# EAGLE design pc_afe44xx_shield_v2 (EAGLE 6.4)
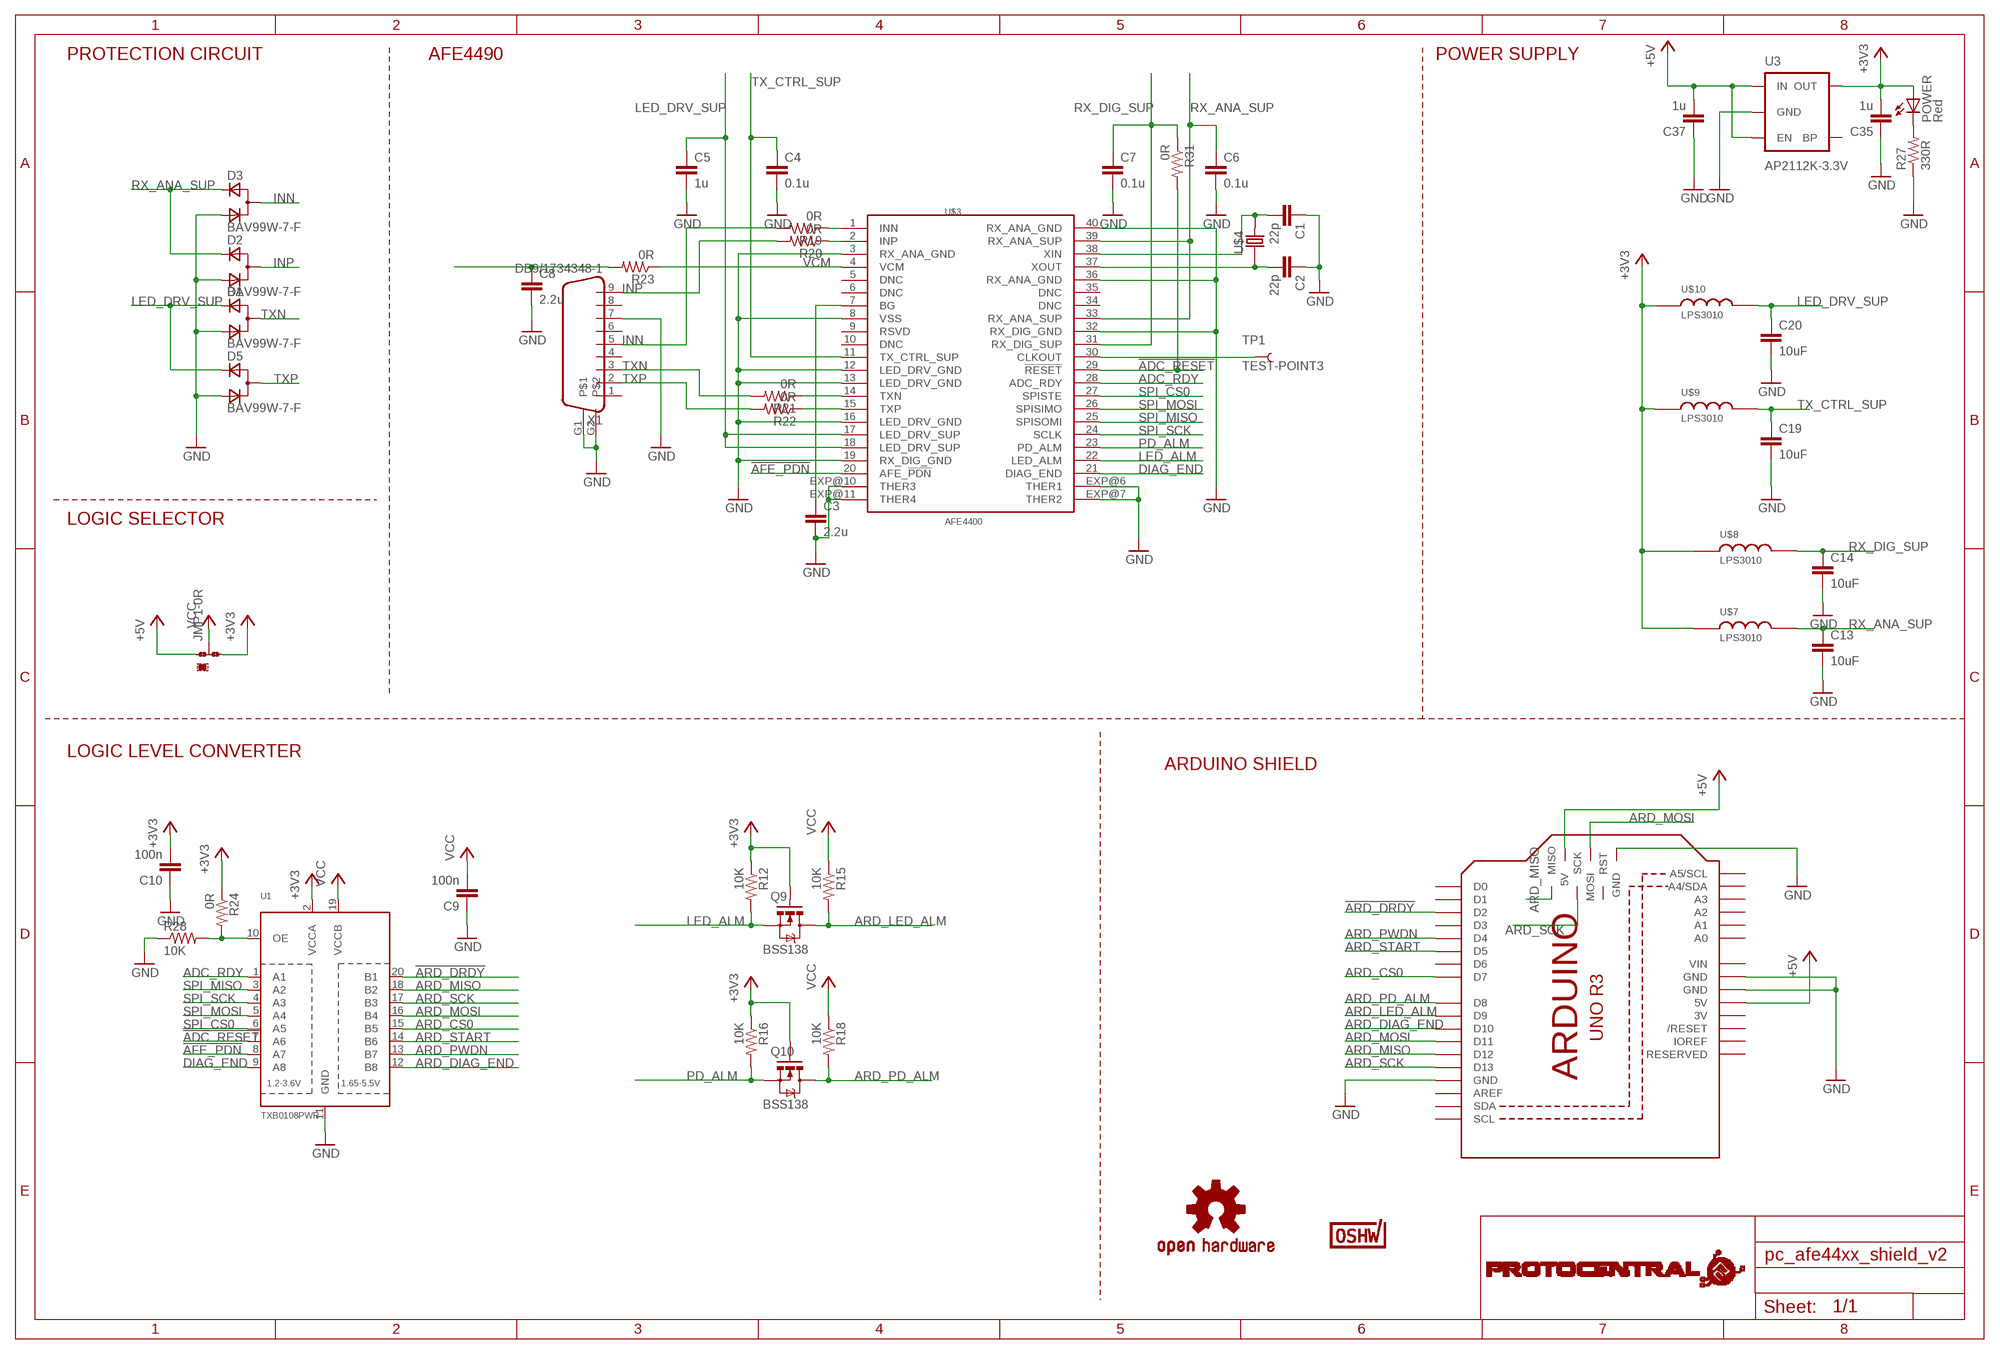
[diagram p0: schematic, sheet 1]

## Parts
C1  22p  C-EUC0402  [C0402]
C2  22p  C-EUC0402  [C0402]
C3  2.2u  C-EUC0402  [C0402]
C4  0.1u  C-EUC0805  [C0805]
C5  1u  C-EUC0805  [C0805]
C6  0.1u  C-EUC0805  [C0805]
C7  0.1u  C-EUC0805  [C0805]
C8  2.2u  C-EUC0402  [C0402]
C9  100n  C-EUC0402  [C0402]
C10  100n  C-EUC0402  [C0402]
C13  10uF  C-EUC0805  [C0805]
C14  10uF  C-EUC0805  [C0805]
C19  10uF  C-EUC0805  [C0805]
C20  10uF  C-EUC0805  [C0805]
C35  1u  C-EUC0805  [C0805]
C37  1u  C-EUC0805  [C0805]
D1  BAV99W-7-F  D_ACACSOT323  [SOT323]
D2  BAV99W-7-F  D_ACACSOT323  [SOT323]
D3  BAV99W-7-F  D_ACACSOT323  [SOT323]
D5  BAV99W-7-F  D_ACACSOT323  [SOT323]
JMP1  0R-JUMPA  [A0R-JMP]
M1  ARDUINO  [ARDUINO]
POWER  Red  LEDCHIPLED_0603  [CHIPLED_0603]
Q9  BSS138  MOSFET-NCHANNELSMD  [SOT23-3]
Q10  BSS138  MOSFET-NCHANNELSMD  [SOT23-3]
R12  10K  RESISTOR0805-RES  [0805]
R15  10K  RESISTOR0805-RES  [0805]
R16  10K  RESISTOR0805-RES  [0805]
R18  10K  RESISTOR0805-RES  [0805]
R19  0R  R-US_R0402  [R0402]
R20  0R  R-US_R0402  [R0402]
R21  0R  R-US_R0805  [R0805]
R22  0R  R-US_R0805  [R0805]
R23  0R  R-US_R0402  [R0402]
R24  0R  RESISTOR0805-RES  [0805]
R27  330R  R-US_R0805  [R0805]
R28  10K  RESISTOR0805-RES  [0805]
R31  0R  R-US_R0805  [R0805]
TP1  TEST-POINT3  [PAD.03X.03]
U1  TXB0108PWR  [TSSOP20]
U3  AP2112K-3.3V  V_REG_LDOSMD  [SOT23-5]
U$3  AFE4400  [QFN-40]
U$4  ABM3  [ABM3]
U$5  PROTY_LOGO_WITH_TEXT  [PROTY_WITH_TEXT]
U$6  CERT-SMALL  [CERT-SMALL-SILK]
U$7  LPS3010  LPS  [LPS]
U$8  LPS3010  LPS  [LPS]
U$9  LPS3010  LPS  [LPS]
U$10  LPS3010  LPS  [LPS]
U$11  OSHW-LOGOM  [OSHW-LOGO-M]
X1  DB9/1734348-1  DB9  [DB9]

## Nets
!ADC_RESET: R31.2 U1.7(A6) U$3.29(!RESET)
!AFE_PDN: U1.8(A7) U$3.20(AFE_!PDN)
!ARD_DRDY: M1.D2 U1.20(B1)
+3V3: C10.2 C35.2 JMP1.3 POWER.A Q9.1(G) Q10.1(G) R12.1 R16.1 R24.1 U1.2(VCCA) U3.5(OUT) U$7.1 U$8.1 U$9.1 U$10.1
+5V: C37.2 JMP1.1 M1.5V M1.5V_ICSP(5V) U3.1(IN) U3.3(EN)
ADC_RDY: U1.1(A1) U$3.28(ADC_RDY)
ARD_CS0: M1.D7 U1.15(B5)
ARD_DIAG_END: M1.D10 U1.12(B8)
ARD_LED_ALM: M1.D9 Q9.3(D) R15.2
ARD_MISO: M1.D12 M1.MISO U1.18(B2)
ARD_MOSI: M1.D11 M1.MOSI U1.16(B4)
ARD_PD_ALM: M1.D8 Q10.3(D) R18.2
ARD_PWDN: M1.D4 U1.13(B7)
ARD_SCK: M1.D13 M1.SCK U1.17(B3)
ARD_START: M1.D5 U1.14(B6)
DIAG_END: U1.9(A8) U$3.21(DIAG_END)
GND: C1.1 C2.1 C3.2 C4.2 C5.2 C6.2 C7.2 C8.2 C9.1 C10.1 C13.2 C14.2 C19.2 C20.2 C35.1 C37.1 D1.2(C) D2.2(C) D3.2(C) D5.2(C) M1.GND M1.GND@1(GND) M1.GND@2(GND) M1.GND@3(GND) R27.1 R28.1 U1.11(GND) U3.2(GND) U$3.3(RX_ANA_GND) U$3.8(VSS) U$3.12(LED_DRV_GND) U$3.13(LED_DRV_GND) U$3.16(LED_DRV_GND) U$3.19(RX_DIG_GND) U$3.32(RX_DIG_GND) U$3.36(RX_ANA_GND) U$3.40(RX_ANA_GND) U$3.EXP@6(THER1) U$3.EXP@7(THER2) U$3.EXP@10(THER3) U$3.EXP@11(THER4) X1.7 X1.G1 X1.G2
INN: D3.1(CA) R19.2 X1.5
INP: D2.1(CA) R20.2 X1.9
LED_ALM: Q9.2(S) R12.2 U$3.22(LED_ALM)
LED_DRV_SUP: C5.1 C20.1 D1.3(A) D5.3(A) U$3.17(LED_DRV_SUP) U$3.18(LED_DRV_SUP) U$10.2
N$2: C3.1 U$3.7(BG)
N$4: R21.1 U$3.14(TXN)
N$5: TP1.P$1 U$3.30(CLKOUT)
N$6: R22.1 U$3.15(TXP)
N$7: POWER.C R27.2
N$8: R19.1 U$3.1(INN)
N$9: C8.1 R23.2
N$10: C1.2 U$3.38(XIN) U$4.2
N$11: C2.2 U$3.37(XOUT) U$4.1
N$12: R24.2 R28.2 U1.10(OE)
N$17: R20.1 U$3.2(INP)
PD_ALM: Q10.2(S) R16.2 U$3.23(PD_ALM)
RX_ANA_SUP: C6.1 C13.1 D2.3(A) D3.3(A) U$3.33(RX_ANA_SUP) U$3.39(RX_ANA_SUP) U$7.2
RX_DIG_SUP: C7.1 C14.1 R31.1 U$3.31(RX_DIG_SUP) U$8.2
SPI_CS0: U1.6(A5) U$3.27(SPISTE)
SPI_MISO: U1.3(A2) U$3.25(SPISOMI)
SPI_MOSI: U1.5(A4) U$3.26(SPISIMO)
SPI_SCK: U1.4(A3) U$3.24(SCLK)
TX_CTRL_SUP: C4.1 C19.1 U$3.11(TX_CTRL_SUP) U$9.2
TXN: D1.1(CA) R21.2 X1.3
TXP: D5.1(CA) R22.2 X1.2
VCC: C9.2 JMP1.2 R15.1 R18.1 U1.19(VCCB)
VCM: R23.1 U$3.4(VCM)
Unconnected: M1.A0 M1.A1 M1.A2 M1.A3 M1.A4(A4/SDA) M1.A5(A5/SCL) M1.AREF M1.D0 M1.D1 M1.D3 M1.D6 M1.IOREF M1.RESERVED M1.RESET(/RESET) M1.RESET_ICSP(RST) M1.SCL M1.SDA U3.4(BP) U$3.5(DNC) U$3.6(DNC) U$3.9(RSVD) U$3.10(DNC) U$3.34(DNC) U$3.35(DNC) X1.1 X1.4 X1.6 X1.8

## Notes on the sheet
- PROTECTION CIRCUIT | AFE4490 | POWER SUPPLY
- LOGIC SELECTOR
- LOGIC LEVEL CONVERTER
- ARDUINO SHIELD

## Power pins joined to a net without a drawn wire
3V: M1.3V
VIN: M1.VIN

## Library data of the parts
C1-C10 C13 C14 C19 C20 C35 C37 = rcl:C-EU: CAPACITOR, European symbol
D1-D3 D5 = zetex:D_ACAC: Dual DIODE; OC_FARNELL: unknown; OC_NEWARK: unknown
JMP1 = jump-0r-smd:0R-JUMP: SMD 0R 0805 Jumper
M1 = circuitects:ARDUINO
POWER = led:LED: LED OSRAM: - CHIPLED LG R971, LG N971, LY N971, LG Q971, LY Q971, LO R971, LY R971 LH N974, LH R974 LS Q976, LO Q976, LY Q976 LO Q996 - Hyper CHIPLED LW Q18S LB Q993, LB Q99A, LB R99A - SideLED LS A670, LO A670, LY A670, LG A670, LP A670 LB A673, LV A673, LT A673, LW A673 LH A674 LY A675 LS A676, LA A676, LO A676, LY A676, LW A676 LS A679, LY A679, LG A679 - Hyper Micro SIDELED® LS Y876, LA Y876, LO Y876, LY Y876 LT Y87S - SmartLED LW L88C, LW L88S LB L89C, LB L89S, LG L890 LS L89K, LO L89K, LY L89K LS L896, LA L896, LO L896, LY L896 - TOPLED LS T670, LO T670, LY T670, LG T670, LP T670 LSG T670, LSP T670, LSY T670, LOP T670, LYG T670 LG T671, LOG T671, LSG T671 LB T673, LV T673, LT T673, LW T673 LH T674 LS T676, LA T676, LO T676, LY T676, LB T676, LH T676, LSB T676, LW T676 LB T67C, LV T67C, LT T67C, LS T67K, LO T67K, LY T67K, LW E67C LS E67B, LA E67B, LO E67B, LY E67B, LB E67C, LV E67C, LT E67C LW T67C LS T679, LY T679, LG T679 LS T770, LO T770, LY T770, LG T770, LP T770 LB T773, LV T773, LT T773, LW T773 LH T774 LS E675, LA E675, LY E675, LS T675 LS T776, LA T776, LO T776, LY T776, LB T776 LHGB T686 LT T68C, LB T68C - Hyper Mini TOPLED® LB M676 - Mini TOPLED Santana® LG M470 LS M47K, LO M47K, LY M47K Source: http://www.osram.convergy.de LUXEON: - LUMILED® LXK2-PW12-R00, LXK2-PW12-S00, LXK2-PW14-U00, LXK2-PW14-V00 LXK2-PM12-R00, LXK2-PM12-S00, LXK2-PM14-U00 LXK2-PE12-Q00, LXK2-PE12-R00, LXK2-PE12-S00, LXK2-PE14-T00, LXK2-PE14-U00 LXK2-PB12-K00, LXK2-PB12-L00, LXK2-PB12-M00, LXK2-PB14-N00, LXK2-PB14-P00, LXK2-PB14-Q00 LXK2-PR12-L00, LXK2-PR12-M00, LXK2-PR14-Q00, LXK2-PR14-R00 LXK2-PD12-Q00, LXK2-PD12-R00, LXK2-PD12-S00 LXK2-PH12-R00, LXK2-PH12-S00 LXK2-PL12-P00, LXK2-PL12-Q00, LXK2-PL12-R00 Source: www.luxeon.com KINGBRIGHT: KA-3528ASYC Source: www.kingbright.com
Q9 Q10 = SparkFun:MOSFET-NCHANNEL
R12 R15 R16 R18 R24 R28 = SparkFun:RESISTOR: Resistor Basic schematic elements and footprints for 0603, 1206, and PTH resistors.
R19-R23 R27 R31 = rcl:R-US_: RESISTOR, American symbol
TP1 = SparkFun:TEST-POINT
U1 = adafruit:TXB0108PWR: 8-Bit Bi-Directional Level Shifter 1.2V-3.6V (VCCA) to 1.65V-5.5V (VCCB) bi-directional level shifter with auto direction sensing. Max data rate - VCCA 1.8V: 20Mbps (50ns), VCCA 3.3V: 100Mbps (10ns) Digikey: 296-21527-1-ND
U3 = SparkFun-PowerIC:V_REG_LDO: Voltage Regulator LDO Standard 150mA LDO voltage regulator in SOT-23 layout. Micrel part MIC5205. BP (by-pass) pin is used to lower output noise with 470pF cap.; PROD_ID: VREG-12457
U$3 = circuitects:AFE4400
U$4 = circuitects:ABM3
U$5 = circuitects:PROTY_LOGO_WITH_TEXT
U$6 = OSHWA:CERT
U$7-U$10 = circuitects:LPS
U$11 = SparkFun:OSHW-LOGO: Open Source Hardware Logo This logo indicates the piece of hardware it is found on incorporates a OSHW license and/or adheres to the definition of open source hardware found here: http://freedomdefined.org/OSHW
X1 = circuitects:DB9: DB9 Connector Standard DB9 (D-Sub 9) serial connector. Can be used for CAN bus as well as RS485 and RS232. Footprint production proven. Spark Fun Electronics SKU : PRT-00429

## Board
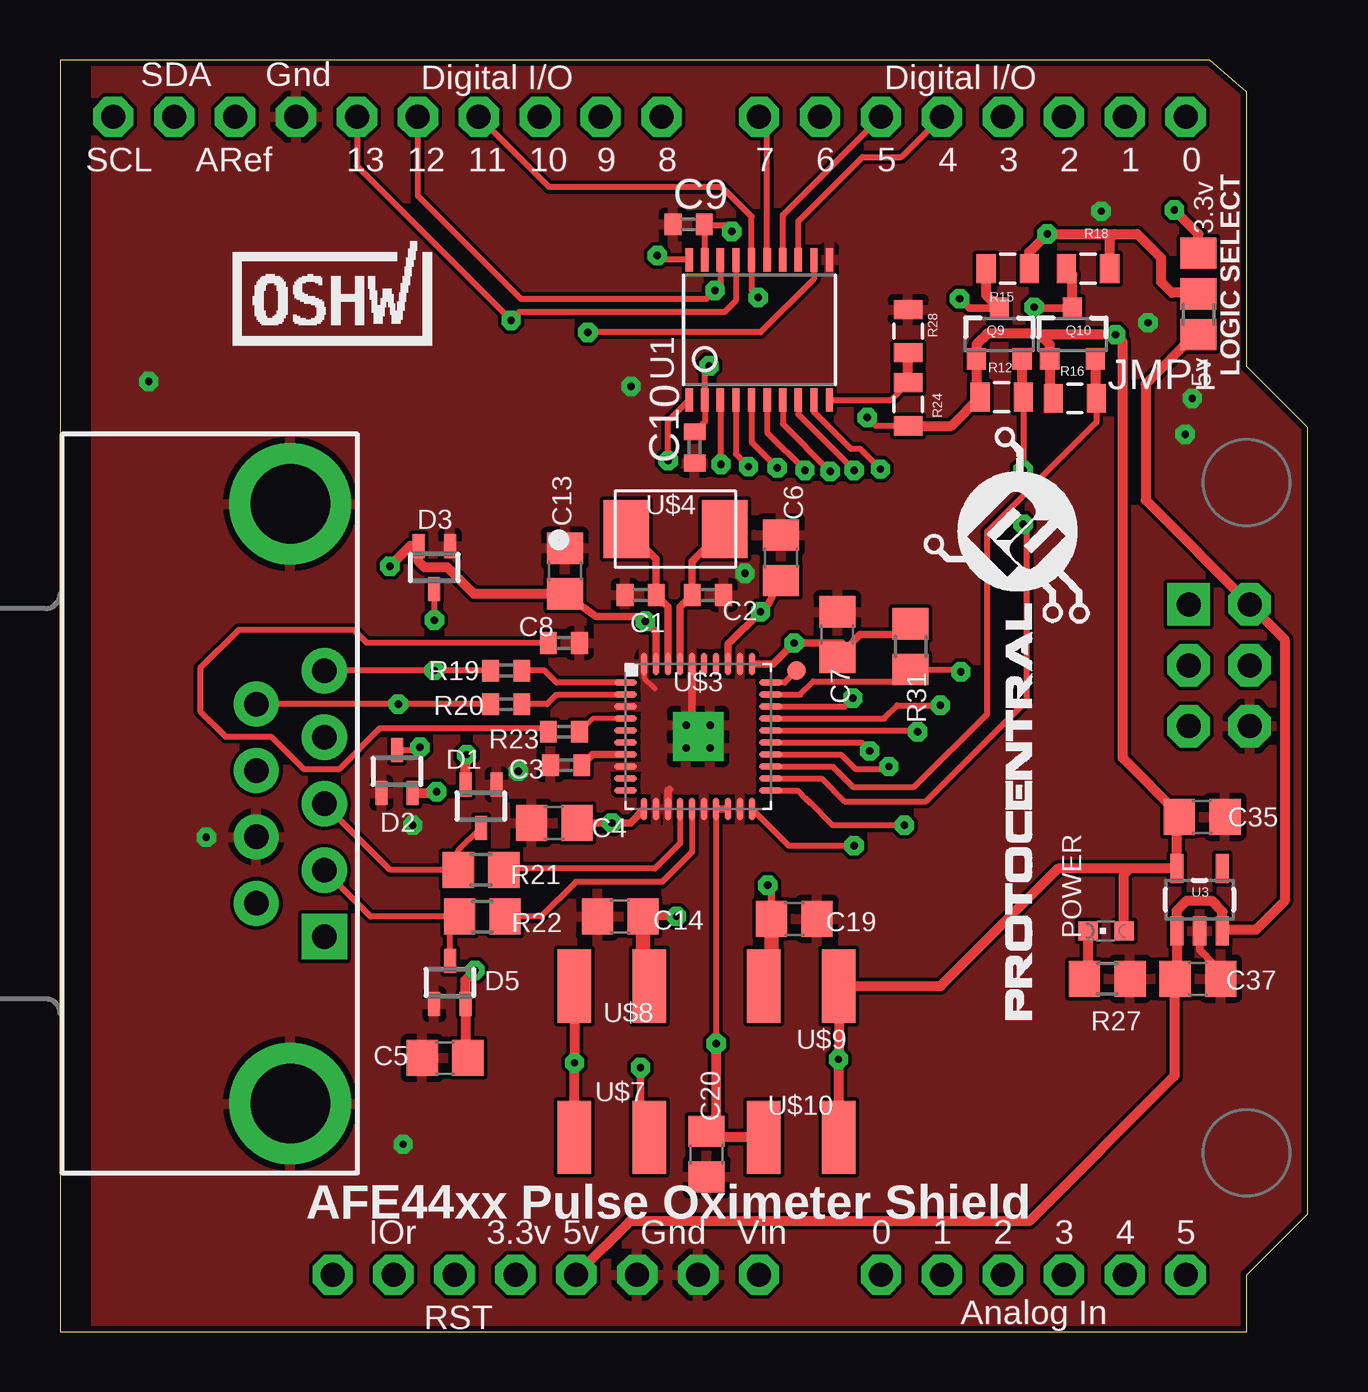
[diagram p1: board, top side]
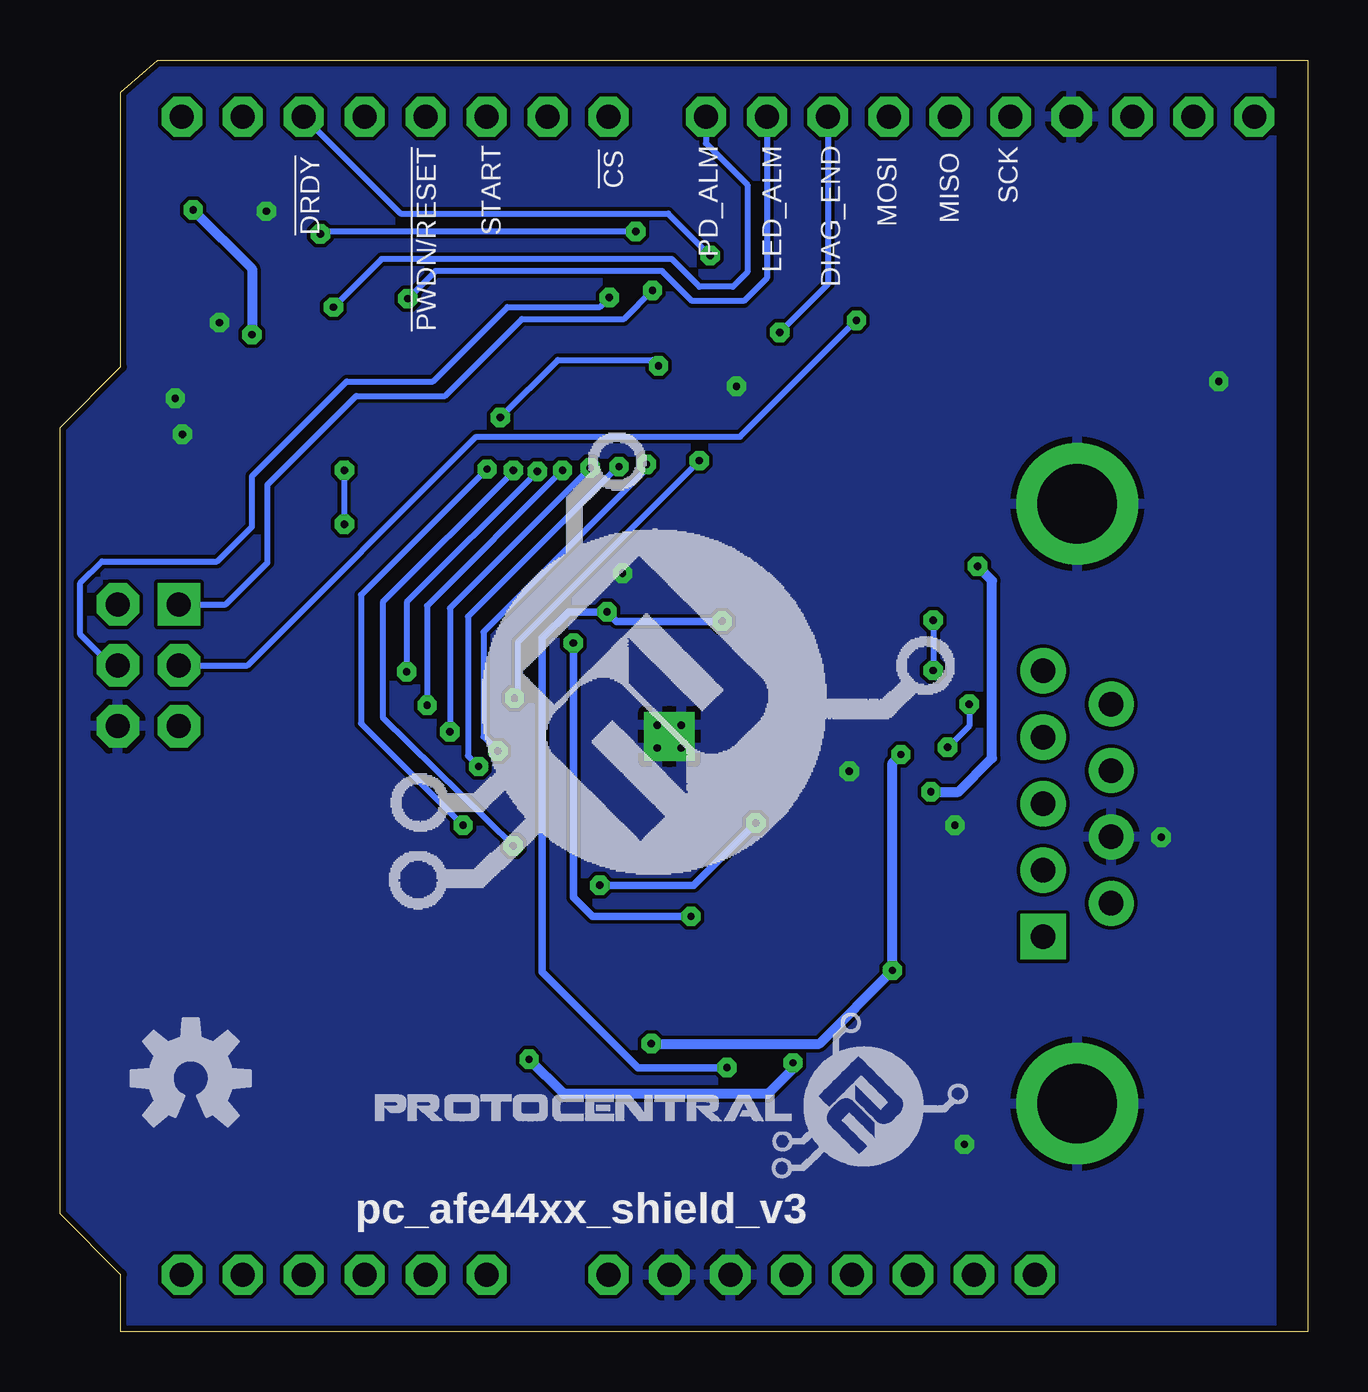
[diagram p2: board, bottom side, seen from below]

Size 52 x 53 mm. Coordinates in mm from the lower left corner, seen from the top.
Copper layers (1*2*15*16): Top 0.035mm / dielectric 1.5mm / Route2 0.035mm / dielectric 0.15mm / Route15 0.035mm / dielectric 0.2mm / Bottom 0.035mm
Design rules "Circuitects-Rules": minimum track width 6mil, minimum drill 0.3mm, track to track 6mil, track to pad 6mil, pad to pad 6mil, via to via 6mil, smd to smd 6mil, copper to edge 10mil, drill to drill 8mil, minimum pad ring 12mil, minimum via ring 10mil, stop-mask expansion 4mil, vias tented up to drill 25mil, thermal gap 10mil

### Footprints (pad centres in the part's own frame; a part is rotated, then mirrored left to right if it is on the bottom)
C0402 = smd 0.7 x 0.9: 1 -0.65,0; 2 0.65,0
C0805 = smd 1.3 x 1.5: 1 -0.95,0; 2 0.95,0
SOT323 = smd 0.5 x 1: 1 0,0.9; 2 -0.65,-0.9; 3 0.65,-0.9
A0R-JMP = smd 1.5 x 1.3: 1 0,1.7; 2 0,0; 3 0,-1.7
ARDUINO = drill 1 pad 1.676 octagon: 3V 18.96,2.34; 5V 21.5,2.34; A0 34.2,2.34; A1 36.74,2.34; A2 39.28,2.34; A3 41.82,2.34; A4 44.36,2.34; A5 46.9,2.34; AREF 7.276,50.6; D0 46.9,50.6; D1 44.36,50.6; D2 41.82,50.6; D3 39.28,50.6; D4 36.74,50.6; D5 34.2,50.6; D6 31.66,50.6; D7 29.12,50.6; D8 25.056,50.6; D9 22.516,50.6; D10 19.976,50.6; D11 17.436,50.6; D12 14.896,50.6; D13 12.356,50.6; GND 9.816,50.6; GND@1 26.58,2.34; GND@2 24.04,2.34; IOREF 13.88,2.34; RESERVED 11.34,2.34; RESET 16.42,2.34; SCL 2.196,50.6; SDA 4.736,50.6; VIN 29.12,2.34 | drill 1 pad 1.778 octagon: 5V_ICSP 49.567,30.28; GND@3 49.567,25.2; MOSI 49.567,27.74; RESET_ICSP 47.027,25.2; SCK 47.027,27.74 | drill 1 pad 1.778 square: MISO 47.027,30.28
CHIPLED_0603 = smd 0.8 x 0.8: A 0,-0.75; C 0,0.75
SOT23-3 = smd 0.8 x 0.9: 1 -0.95,-1; 2 0.95,-1; 3 0,1.1
0805 = smd 0.8 x 1.2: 1 -0.9,0; 2 0.9,0
R0402 = smd 0.7 x 0.9: 1 -0.65,0; 2 0.65,0
R0805 = smd 1.3 x 1.5: 1 -0.95,0; 2 0.95,0
PAD.03X.03 = smd 0.762 x 0.762: P$1 0,0
TSSOP20 = smd 0.305 x 0.991: 1 -2.925,-2.918; 2 -2.275,-2.918; 3 -1.625,-2.918; 4 -0.975,-2.918; 5 -0.325,-2.918; 6 0.325,-2.918; 7 0.975,-2.918; 8 1.625,-2.918; 9 2.275,-2.918; 10 2.925,-2.918; 11 2.925,2.918; 12 2.275,2.918; 13 1.625,2.918; 14 0.975,2.918; 15 0.325,2.918; 16 -0.325,2.918; 17 -0.975,2.918; 18 -1.625,2.918; 19 -2.275,2.918; 20 -2.925,2.918
SOT23-5 = smd 0.55 x 1.2: 1 -0.95,-1.3; 2 0,-1.3; 3 0.95,-1.3; 4 0.95,1.3; 5 -0.95,1.3
QFN-40 = smd 0.95 x 0.28: 1 -3.025,2.25; 2 -3.025,1.75; 3 -3.025,1.25; 4 -3.025,0.75; 5 -3.025,0.25; 6 -3.025,-0.25; 7 -3.025,-0.75; 8 -3.025,-1.25; 9 -3.025,-1.75; 10 -3.025,-2.25; 21 3.025,-2.25; 22 3.025,-1.75; 23 3.025,-1.25; 24 3.025,-0.75; 25 3.025,-0.25; 26 3.025,0.25; 27 3.025,0.75; 28 3.025,1.25; 29 3.025,1.75; 30 3.025,2.25 | smd 0.28 x 0.95: 11 -2.25,-3.025; 12 -1.75,-3.025; 13 -1.25,-3.025; 14 -0.75,-3.025; 15 -0.25,-3.025; 16 0.25,-3.025; 17 0.75,-3.025; 18 1.25,-3.025; 19 1.75,-3.025; 20 2.25,-3.025; 31 2.25,3.025; 32 1.75,3.025; 33 1.25,3.025; 34 0.75,3.025; 35 0.25,3.025; 36 -0.25,3.025; 37 -0.75,3.025; 38 -1.25,3.025; 39 -1.75,3.025; 40 -2.25,3.025 | drill 0.3 pad 1.1 square: EXP@6 -0.5,0.475; EXP@7 0.5,0.475; EXP@10 -0.5,-0.475; EXP@11 0.5,-0.475
ABM3 = smd 1.9 x 2.4: 1 -2.05,0; 2 2.05,0
LPS = smd 1.4 x 3.05: 1 -1.56,0; 2 1.56,0
DB9 = drill 1.016 pad 1.88 square: 1 -5.54,-1.42 | drill 1.016 pad 1.88: 2 -2.77,-1.42; 3 0,-1.42; 4 2.77,-1.42; 5 5.54,-1.42; 6 -4.15,1.42; 7 -1.38,1.42; 8 1.38,1.42; 9 4.15,1.42 | drill 3.302 pad 5.08: G1 -12.5,0; G2 12.5,0

### Placement (x,y rotation side)
C1  24.2,30.7 0 top
C2  27,30.7 180 top
C3  21.1,23.6 180 top
C4  20.6,21.2 180 top
C5  16.05,11.4 180 top
C6  30.05,32.25 90 top
C7  32.4,29.05 90 top
C8  21,28.7 0 top
C9  26.2,46.15 0 top
C10  26.45,36.85 90 top
C13  21.05,31.7 90 top
C14  23.35,17.3 180 top
C19  30.6,17.2 0 top
C20  26.95,7.4 270 top
C35  47.61,21.45 180 top
C37  47.43,14.7 180 top
D1  17.55,21.9 180 top
D2  14.05,23.35 0 top
D3  15.6,31.85 180 top
D5  16.25,14.55 0 top
JMP1  47.45,43.25 180 top
M1  0.02,0.03 0 top
POWER  43.6,16.7 90 top
Q9  39.15,41.55 0 top
Q10  42.2,41.55 0 top
R12  39.25,38.95 0 top
R15  39.5,44.3 180 top
R16  42.3,38.9 0 top
R18  42.85,44.3 180 top
R19  18.6,27.55 180 top
R20  18.6,26.15 180 top
R21  17.55,19.25 180 top
R22  17.6,17.3 180 top
R23  21,25 180 top
R24  35.35,38.65 90 top
R27  43.65,14.7 180 top
R28  35.35,41.7 270 top
R31  35.45,28.55 270 top
TP1  30.7,27.55 0 top
U1  29.15,41.75 0 top
U3  47.5,18 0 top
U$1  [PROTY_WITH_TEXT]  42.55,13 90 top
U$2  [PROTY-LOGO-LARGE]  38.5,17.25 0 bottom
U$3  26.6,24.8 0 top
U$4  25.65,33.45 180 top
U$5  38.85,6.75 0 bottom
U$6  11.35,41.1 0 top
U$7  23,8.1 0 top
U$8  23,14.4 0 top
U$9  30.9,14.4 180 top
U$10  30.9,8.1 180 top
U$11  46.55,10.55 0 bottom
X1  9.6,22 90 top

### Tracks (layer width: path | path; a pad name or v marks a point on that pad's centre or on a via)
!ADC_RESET  (via drill 0.3)
  Top 0.254: U$3.29 30.85,26.55 31.4,27.1 34.95,27.1 R31.2 37.45,27.6 v37.55,27.5 | U1.7 30.12,37.83 v32.1,35.85
  Bottom 0.254: v32.1,35.85 37.55,30.4 v37.55,27.5
!AFE_PDN  (via drill 0.3)
  Top 0.254: U1.8 30.77,38.23 v33.1,35.9 | v33.1,20.25 30.38,20.25 U$3.20
  Bottom 0.254: v33.1,35.9 33.1,35.85 38.55,30.4 38.55,25.6 v33.1,20.25
!ARD_DRDY  (via drill 0.3)
  Top 0.254: U1.20 25.08,44.67 v24.9,44.85
  Bottom 0.254: M1.D2 37.81,46.6 26.65,46.6 v24.9,44.85
+3V3  (via drill 0.3)
  Top 0.254: R24.1 34,37.75 v33.65,38.1 | v27.05,40.25 26.88,40.08 U1.2 26.88,37.92 C10.2
  Top 0.406: U$8.1 v21.44,11.21 v21.45,11.2 v21.44,11.19 U$7.1 | U$10.1 v32.46,11.34 v32.45,11.35 v32.46,11.36 U$9.1 36.7,14.4 41.6,19.3 44.6,19.3 | 44.6,19.3 U3.5 46.55,21.34 C35.2 46.66,21.54 44.3,23.9 44.3,41.25 v44,41.55 40.95,41.55 40.9,41.5 | 40.9,41.5 41.25,41.15 Q10.1 41.25,39.05 R16.1 | 40.9,41.5 40.8,41.6 38.65,41.6 38.2,41.15 Q9.1 38.2,39.1 R12.1 37.15,37.75 R24.1 | JMP1.3 47.45,45.75 v46.45,46.75 | POWER.A 44.35,19.05 44.6,19.3
  Bottom 0.254: v33.65,38.1 31.25,40.5 27.3,40.5 v27.05,40.25
  Bottom 0.406: v21.45,11.2 21.45,10.95 22.5,9.9 31,9.9 v32.45,11.35 | v46.45,46.75 44,44.3 v44,41.55
+5V
  Top 0.305: 46.74,14.99 C37.2 46.45,14.67
  Top 0.406: JMP1.1 47.3,41.55 45.25,39.5 45.25,34.65 M1.5V_ICSP 51.05,28.85 51.05,17.95 49.85,16.75 48.5,16.75 U3.3 48.45,17.5 48,17.95 46.95,17.95 46.55,17.55 U3.1 46.55,14.77 C37.2 | M1.5V 23.75,4.6 40.4,4.6 46.45,10.65 46.45,14.67
ADC_RDY  (via drill 0.3)
  Top 0.254: U$3.28 32.7,26.05 v33.05,26.4 | v25.35,36.3 25.35,37.96 U1.1
  Bottom 0.254: v33.05,26.4 32.9,26.55 32.9,28.75 v25.35,36.3
ARD_CS0
  Top 0.254: U1.15 29.48,50.3 M1.D7
ARD_DIAG_END  (via drill 0.3)
  Top 0.254: U1.12 31.43,43.88 29.2,41.65 v22,41.65
  Bottom 0.254: M1.D10 20,43.65 v22,41.65
ARD_LED_ALM  (via drill 0.3)
  Top 0.305: Q9.3 37.9,42.65 v37.5,43.05
  Top 0.406: R15.2 38.6,43.2 Q9.3
  Bottom 0.254: M1.D9 22.54,43.91 23.5,42.95 25.65,42.95 26.9,44.2 36.35,44.2 v37.5,43.05
ARD_MISO  (via drill 0.3)
  Top 0.254: M1.D12 14.92,47.33 19.2,43.05 26.95,43.05 v27.3,43.4 27.52,43.62 U1.18
  Bottom 0.254: M1.MISO 45.09,30.31 43.35,32.05 43.35,35.3 39.65,39 35.95,39 32.75,42.2 28.5,42.2 v27.3,43.4
ARD_MOSI  (via drill 0.3)
  Top 0.254: M1.D11 20.39,47.7 27.6,47.7 28.82,46.48 U1.16 28.82,43.38 v29.1,43.1
  Bottom 0.254: M1.MOSI 49.87,27.77 51.15,29.05 51.15,31.2 50.25,32.1 45.45,32.1 44,33.55 44,35.65 40.05,39.6 36.45,39.6 33.35,42.7 29.5,42.7 v29.1,43.1
ARD_PD_ALM  (via drill 0.3)
  Top 0.305: Q10.3 40.65,42.65 v40.6,42.7
  Top 0.406: Q10.3 42.2,44.05 R18.2
  Bottom 0.254: M1.D8 25.08,49.53 23.35,47.8 23.35,44.15 23.95,43.55 25.35,43.55 26.5,44.7 38.6,44.7 v40.6,42.7
ARD_PWDN
  Top 0.254: U1.13 30.77,46.27 33.45,48.95 35.08,48.95 M1.D4
ARD_SCK  (via drill 0.3)
  Top 0.254: M1.D13 12.38,48.57 v18.8,42.15 19.15,42.5 27.7,42.5 28.18,42.98 U1.17
  Bottom 0.254: M1.SCK 44.18,27.77 34.65,37.3 23.65,37.3 v18.8,42.15
ARD_START
  Top 0.254: U1.14 30.12,46.53 M1.D5
DIAG_END  (via drill 0.3)
  Top 0.254: U1.9 31.43,38.33 32.95,36.8 33.35,36.8 v34.2,35.95 | v35.2,21.1 32.2,21.1 31.25,22.05 31.1,22.2 30.75,22.55 U$3.21
  Bottom 0.254: v34.2,35.95 39.45,30.7 39.45,25.35 v35.2,21.1
GND  (via drill 0.3)
  Top 0.2: U$3.40 24.35,27.25 24.8,26.8
  Top 0.254: C37.1 48.08,15.02
  Top 0.305: U$3.36 26.35,25.52 U$3.EXP@6 | U$3.13 25.35,22.55 25.4,22.6 | 48.08,15.02 48.08,15.32 47.5,15.9 U3.2
  Bottom 0.305: U$3.EXP@10 U$3.EXP@11 U$3.EXP@7 U$3.EXP@6
  other vias: 45.35,42.05 14.3,7.8 3.7,39.6 47.2,38.9 46.9,37.4 43.4,46.7 23.8,39.4 19.1,23.35 6.1,20.6 14.7,21.1 28.55,31.6
  pour Top: 1.5,53.4 51.8,53.3 51.8,0 1.5,0
  pour Bottom: 1.5,53.5 52,53.3 51.9,-0.2 1.5,-0.1
INN  (via drill 0.3)
  Top 0.254: R19.2 v15.6,27.55 X1.5 | D3.1 v15.6,29.65
  Bottom 0.254: v15.6,29.65 v15.6,27.55
INP  (via drill 0.3)
  Top 0.254: v14.1,26.15 R20.2 X1.9 | D2.1 14.9,24.25 v15,24.35
  Bottom 0.254: v14.1,26.15 14.1,25.25 v15,24.35
LED_ALM  (via drill 0.3)
  Top 0.254: U$3.22 31.75,23.05 32.7,22.1 36.1,22.1 40.3,26.3 40.3,33.5 v40.15,33.65 | R12.2 v40.15,35.9
  Top 0.406: Q9.2 40.1,39 R12.2
  Bottom 0.254: v40.15,35.9 v40.15,33.65
LED_DRV_SUP  (via drill 0.3)
  Top 0.254: U$3.17 v27.35,12
  Top 0.305: U$3.18 U$3.17
  Top 0.406: C5.1 16.9,11.5 D5.3 16.9,14.65 v17.3,15.05 | D1.3 16.9,24 v16.95,24.05 | v27.35,12 27.35,8.75 C20.1 27.2,8.1 U$10.2
  Bottom 0.406: v27.35,12 20.35,12 v17.3,15.05 17.3,23.7 v16.95,24.05
N$2
  Top 0.305: U$3.7 22.2,24.05 C3.1
N$4
  Top 0.254: U$3.14 25.85,20.35 24.8,19.3 18.55,19.3 R21.1
N$5
  Top 0.254: TP1.P$1 30.2,27.05 U$3.30
N$6
  Top 0.254: U$3.15 26.35,20 25.1,18.75 21.5,18.75 20.05,17.3 R22.1
N$7
  Top 0.406: POWER.C 42.85,14.85 R27.2
N$8
  Top 0.254: U$3.1 20.7,27.05 20.2,27.55 R19.1
N$9
  Top 0.254: C8.1 12.8,28.7 12.25,29.25 7.45,29.25 5.85,27.65 5.85,25.85 6.9,24.8 8.8,24.8 10.15,23.45 11.65,23.45 13.35,25.15 20.2,25.15 R23.2
N$10
  Top 0.305: U$3.38 25.35,30.2 C1.2 24.85,32.2 U$4.2
N$11
  Top 0.305: U$3.37 25.85,30.2 C2.2 26.35,32.1 U$4.1
N$12
  Top 0.254: U1.10 34.63,38.83 R24.2
  Top 0.406: R24.2 R28.2
N$17
  Top 0.254: U$3.2 20.7,26.55 20.3,26.15 R20.1
PD_ALM
  Top 0.254: U$3.23 32.2,23.55 33.05,22.7 35.6,22.7 38.65,25.75 38.65,33.35 43.2,37.9 R16.2
  Top 0.406: Q10.2 43.15,38.95 R16.2
RX_ANA_SUP  (via drill 0.3)
  Top 0.305: U$3.39 24.85,29.15 v24.4,29.6 24.2,29.8 22.35,29.8 C13.1 | U$3.33 27.85,28.65 v29.2,30 29.5,30.3 C6.1 | v24.2,11 24.2,8.17 U$7.2
  Top 0.406: D2.3 15.65,22.45 v15.7,22.5 | v13.75,31.9 14.6,32.75 D3.3 14.95,32.1 15.2,31.85 16.15,31.85 17.25,30.75 C13.1
  Bottom 0.305: v24.2,11 27.9,11 31.9,15 31.9,28.9 30.8,30 v29.2,30 28.8,29.6 v24.4,29.6
  Bottom 0.406: v15.7,22.5 14.55,22.5 13.15,23.9 13.15,31.3 v13.75,31.9
RX_DIG_SUP  (via drill 0.3)
  Top 0.305: U$3.31 29.73,27.82 v30.6,28.7 32.6,28.7 32.8,28.5 | C14.1 v25.7,17.3 | R31.1 35.25,29.5 34.8,29.05 33.35,29.05 32.8,28.5 | 32.8,28.5 C7.1
  Top 0.61: C14.1 24.3,14.66 U$8.2
  Bottom 0.305: v30.6,28.7 30.6,18.1 29.8,17.3 v25.7,17.3
SPI_CS0  (via drill 0.3)
  Top 0.254: U1.6 29.48,37.48 v31.05,35.9 | U$3.27 34.35,25.55 34.9,26.1 v36.7,26.1
  Bottom 0.254: v31.05,35.9 36.7,30.25 v36.7,26.1
SPI_MISO  (via drill 0.3)
  Top 0.254: U1.3 27.52,36.17 v27.55,36.15 | U$3.25 33.4,24.55 v33.75,24.2
  Bottom 0.254: v27.55,36.15 27.55,35.95 34.35,29.15 34.35,24.8 v33.75,24.2
SPI_MOSI  (via drill 0.3)
  Top 0.254: U1.5 28.82,37.08 v29.9,36 | U$3.26 35.7,25.05 v35.75,25
  Bottom 0.254: v29.9,36 35.75,30.15 v35.75,25
SPI_SCK  (via drill 0.3)
  Top 0.254: U1.4 28.18,36.58 v28.7,36.05 | U$3.24 32.55,24.05 33.15,23.45 34.45,23.45 v34.55,23.55
  Bottom 0.254: v28.7,36.05 28.75,36.05 35,29.8 35,24 v34.55,23.55
TX_CTRL_SUP  (via drill 0.3)
  Top 0.305: U$3.11 23.77,21.2 v23,21.2 C4.1 | C19.1 29.65,18.45 v29.5,18.6
  Top 0.61: C19.1 29.65,14.71 U$9.2
  Bottom 0.305: v29.5,18.6 25.6,18.6 v23,21.2
TXN
  Top 0.254: X1.3 13.77,19.25 R21.2 16.6,20.05 D1.1
TXP
  Top 0.254: R22.2 16.05,17.3 | 16.05,17.3 12.95,17.3 X1.2 | D5.1 16.25,17.1 16.05,17.3
VCC  (via drill 0.3)
  Top 0.254: U1.19 26.88,46.12 | 26.88,46.12 C9.2 | 26.88,46.12 27.73,46.12 v28,45.85 | 47.4,43.3 JMP1.2
  Top 0.406: R15.1 40.4,45 v41.15,45.75 43.95,45.75 | 43.95,45.75 44.9,45.75 45.9,44.75 45.9,43.75 46.35,43.3 47.4,43.3 | R18.1 43.75,45.55 43.95,45.75
  Bottom 0.254: v28,45.85 41.05,45.85 v41.15,45.75
VCM
  Top 0.2: U$3.4 22.2,25.55 R23.1

### Text on the board
tPlace: 3.3v | LOGIC SELECT | 5v | AFE44xx Pulse Oximeter Shield
bPlace: SCK | MISO | MOSI | DIAG_END | LED_ALM | PD_ALM | !CS | START | !PWDN/RESET | !DRDY | pc_afe44xx_shield_v3